# Altium schematic sheet Schematic.SchDoc
size A
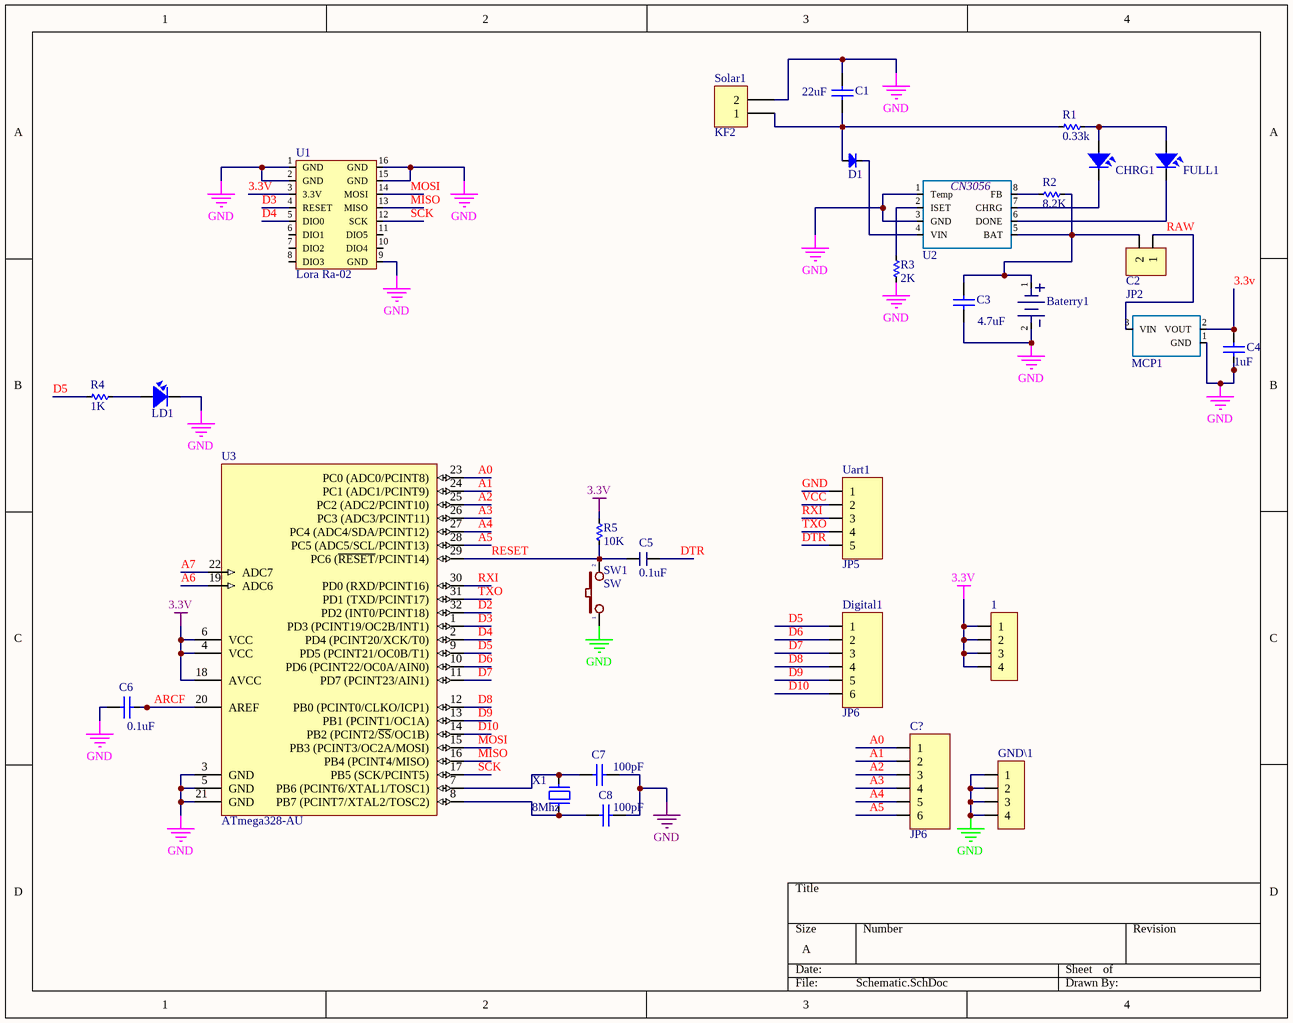
[diagram p0: Schematic.SchDoc]

## Parts
1  JP4  [JP4-D1T]  (value not drawn)
Baterry1  18650 Baterry  [18650 Baterry]  (value not drawn)
C1  22uF  [CAP_0805]
C2  JP2  [JP2-D1T]
C3  4.7uF  [CAP_0805]
C4  1uF  [CAP_0805]
C5  0.1uF  [CAP_0805]
C6  0.1uF  [CAP_0805]
C7  100pF  [C0805]
C8  100pF  [C0805]
C?  JP6  [JP6-D1T]
CHRG1  LED  [LED-0805-Red]  (value not drawn)
D1  S1g  [DIO-SMD-106]  (value not drawn)
Digital1  JP6  [JP6-D1T]
FULL1  LED  [LED-0805-Blue]  (value not drawn)
GND\1  JP4  [JP4-D1T]  (value not drawn)
LD1  LED  [LED-0805-Yellow]  (value not drawn)
MCP1  MCP1700T  [SOT23-3]  (value not drawn)
R1  0.33k  [RES-SMD-0805]
R2  8.2K  [RES-SMD-0805]
R3  2K  [RES-SMD-0805]
R4  1K  [RES-SMD-0805]
R5  10K  [RES-SMD-0805]
Solar1  KF2  [KF2-3.5]
SW1  SW  [SW1-SMD]
U1  Lora Ra-02  [Ra-02]
U2  CN3056  [DFN-8]  (value not drawn)
U3  ATmega328-AU  [TQFP32]
Uart1  JP5  [JP5-D1T]
X1  8Mhz  [XT2-32.768KHz-2_V]

## Nets
3.3V: 1.1 1.2 1.3 1.4 C4.2 MCP1.2(VOUT) R5.1 U1.3(3.3V) U3.4(VCC) U3.6(VCC) U3.18(AVCC)
GND: Baterry1.2 C1.2 C3.1 C4.1 C6.1 C7.2 C8.2 GND\1.1 GND\1.2 GND\1.3 GND\1.4 LD1.2 MCP1.1(GND) R3.2 Solar1.2 SW1.1 U1.1(GND) U1.2(GND) U1.9(GND) U1.15(GND) U1.16(GND) U2.1(Temp) U2.3(GND) U3.3(GND) U3.5(GND) U3.21(GND) Uart1.1
A0: C?.1 U3.23(PC0_(ADC0/PCINT8))
A1: C?.2 U3.24(PC1_(ADC1/PCINT9))
A2: C?.3 U3.25(PC2_(ADC2/PCINT10))
A3: C?.4 U3.26(PC3_(ADC3/PCINT11))
A4: C?.5 U3.27(PC4_(ADC4/SDA/PCINT12))
A5: C?.6 U3.28(PC5_(ADC5/SCL/PCINT13))
A6: U3.19(ADC6)
A7: U3.22(ADC7)
ARCF: C6.2 U3.20(AREF)
D2: U3.32(PD2_(INT0/PCINT18))
D3: U1.4(RESET) U3.1(PD3_(PCINT19/OC2B/INT1))
D4: U1.5(DIO0) U3.2(PD4_(PCINT20/XCK/T0))
D5: Digital1.1 R4.2 U3.9(PD5_(PCINT21/OC0B/T1))
D6: Digital1.2 U3.10(PD6_(PCINT22/OC0A/AIN0))
D7: Digital1.3 U3.11(PD7_(PCINT23/AIN1))
D8: Digital1.4 U3.12(PB0_(PCINT0/CLKO/ICP1))
D9: Digital1.5 U3.13(PB1_(PCINT1/OC1A))
D10: Digital1.6 U3.14(PB2_(PCINT2/~{SS}/OC1B))
DTR: C5.2 Uart1.5
MISO: U1.13(MISO) U3.16(PB4_(PCINT4/MISO))
MOSI: U1.14(MOSI) U3.15(PB3_(PCINT3/OC2A/MOSI))
RAW: C2.1 MCP1.3(VIN)
RESET: C5.1 R5.2 SW1.2 U3.29(PC6_(~{RESET}/PCINT14))
RXI: U3.30(PD0_(RXD/PCINT16)) Uart1.3
SCK: U1.12(SCK) U3.17(PB5_(SCK/PCINT5))
TXO: U3.31(PD1_(TXD/PCINT17)) Uart1.4
VCC: Uart1.2
NetBaterry1_1: Baterry1.1(B+) C2.2 C3.2 R2.1 U2.5(BAT)
NetC1_1: C1.1 D1.1(A) R1.2 Solar1.1
NetC7_1: C7.1 U3.7(PB6_(PCINT6/XTAL1/TOSC1)) X1.2
NetC8_1: C8.1 U3.8(PB7_(PCINT7/XTAL2/TOSC2)) X1.1
NetCHRG1_1: CHRG1.1 FULL1.1 R1.1
NetCHRG1_2: CHRG1.2 U2.7(CHRG)
NetD1_2: D1.2(K) U2.4(VIN)
NetFULL1_2: FULL1.2 U2.6(DONE)
NetLD1_1: LD1.1 R4.1
NetR2_2: R2.2 U2.8(FB)
NetR3_1: R3.1 U2.2(ISET)

Not connected (* = marked no-connect by the designer): U1 6(DIO1) 7(DIO2) 8(DIO3) 10(DIO4) 11(DIO5)

## Library data of the parts
1 GND\1 = JP4: WR-PHD 2.54 mm Angled Socket Header; Manufacturer: W¨¹rth Elektronik eiSos GmbH; partNo: 613004143121; ComponentLink1 Description: Manufacturer; ComponentLink2 Description: Datasheet; NoPins: 04; Created Date: 29 March 2013; ComponentLink1URL: http://www.we-online.com; ComponentLink2URL: http://katalog.we-online.de/em/datasheet/6130xx143121.pdf; Created by: Karrer Zheng
C1 C3 C4 C6-C8 = CapSMD: Capacitor; Value: 33p; Published: 8-Jun-2000; LatestRevisionDate: 17-Jul-2002; LatestRevisionNote: Re-released for DXP Platform.; PackageReference: RAD-0.3; Publisher: Altium Limited
C2 = JP2: WR-PHD 2.54 mm Angled Socket Header; Manufacturer: W¨¹rth Elektronik eiSos GmbH; partNo: 613002143121; ComponentLink1 Description: Manufacturer; ComponentLink2 Description: Datasheet; NoPins: 02; Created Date: 29 March 2013; ComponentLink1URL: http://www.we-online.com; ComponentLink2URL: http://katalog.we-online.de/em/datasheet/6130xx143121.pdf; Created by: Karrer Zheng
C5 = C104 SMD: 0603 SMD CAP
C? Digital1 = JP6: WR-PHD 2.54 mm Angled Socket Header; Manufacturer: W¨¹rth Elektronik eiSos GmbH; partNo: 613006143121; ComponentLink1 Description: Manufacturer; ComponentLink2 Description: Datasheet; NoPins: 06; Created Date: 29 March 2013; ComponentLink1URL: http://www.we-online.com; ComponentLink2URL: http://katalog.we-online.de/em/datasheet/6130xx143121.pdf; Created by: Karrer Zheng
CHRG1 FULL1 LD1 = LED SMD: Value: LED 3 - 5 ly 2 Colour
D1 = Diode SMD: Default Diode; Code - JEDEC: DO-214-AB; Value: 1N5007; Published: 8-Jun-2000; Revision: July-2002: Re-released for DXP Platform.; Publisher: Altium Limited
R1-R5 = Res-SMD: Resistor; Manufacturer: Generic Components; Class: Passive; Published: 08/06/2000; Publisher: Altium Hobart Technology Centre
Solar1 = KF2: Manufacturer: Würth Elektronik eiSos GmbH; partNo: 691103110002; ComponentLink1 Description: Manufacturer; ComponentLink2 Description: Datasheet; NoPins: 2; Created Date: 29 October 2013; ComponentLink1URL: http://www.we-online.com; ComponentLink2URL: http://katalog.we-online.de/em/datasheet/6911031100xx.pdf; Created by: Karrer Zheng
SW1 = SW2: Switch button 2 pin; Value: SW chip 2 pin
U3 = ATmega328-AU: 8-bit AVR Microcontroller, 32KB Flash, 1KB EEPROM, 2KB SRAM, 32-pin TQFP, Industrial Grade (-40°C to 85°C); Published: 1-Apr-2010; DatasheetVersion: revA, Jan-2010; PackageVersion: revB, Oct-2001; PackageReference: 32A; Publisher: Altium Limited; PackageDescription: 32-Lead, 7x7x1.0 mm Body, 0.8mm Lead Pitch, Thin Profile Plastic Quad Flat Package (TQFP); Supplier 1: Digi-Key; Supplier Part Number 1: ATMEGA328-AU-ND; Supplier 2: Mouser; Supplier Part Number 2: 556-ATMEGA328-AU; Code_JEDEC: MS-026-ABA; ComponentLink1Description: Manufacturer Link; ComponentLink1URL: http://www.atmel.com/products/avr/default.asp?; ComponentLink2Description: ATmega48A/48PA/88A/88PA/168A/168PA/328/328P Datasheet; ComponentLink2URL: http://www.atmel.com/dyn/resources/prod_documents/8271.pdf; ComponentLink3Description: ATmega48A/48PA/88A/88PA/168A/168PA/328/328P Summary; ComponentLink3URL: http://www.atmel.com/dyn/resources/prod_documents/8271S.pdf; ComponentLink4Description: Atmel.com Home; ComponentLink4URL: http://www.atmel.com
Uart1 = JP5: WR-PHD 2.54 mm Angled Socket Header; Manufacturer: W¨¹rth Elektronik eiSos GmbH; partNo: 613005143121; ComponentLink1 Description: Manufacturer; ComponentLink2 Description: Datasheet; NoPins: 05; Created Date: 29 March 2013; ComponentLink1URL: http://www.we-online.com; ComponentLink2URL: http://katalog.we-online.de/em/datasheet/6130xx143121.pdf; Created by: Karrer Zheng
X1 = XT2: Crystal, 32.768 KHz, -40 to 85 degC, 3.2 x 1.5 x 0.9 mm SMD; Value: 4Mhz